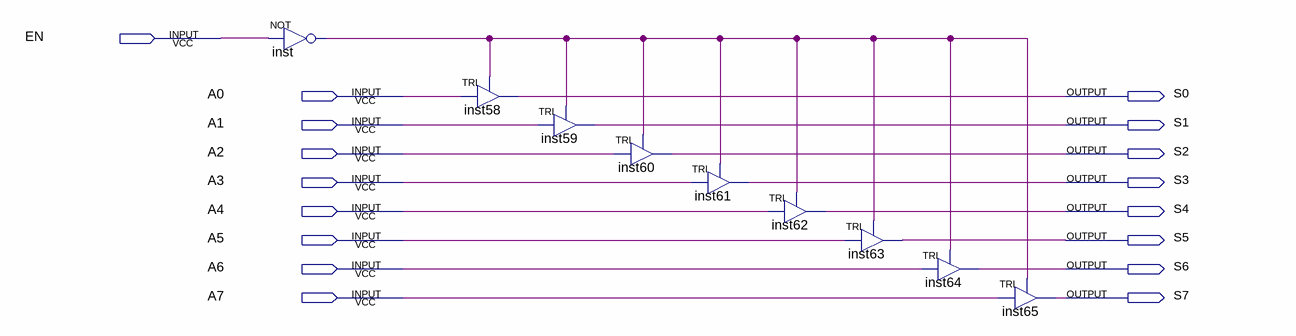
[diagram p0: schematic sheet]
// Quartus schematic Octal_Buffer_Tri.bdf as structural Verilog: 9 symbols, 17 pins
module Octal_Buffer_Tri (
  input  EN,
  input  A0,
  input  A1,
  input  A2,
  input  A3,
  input  A4,
  input  A5,
  input  A6,
  input  A7,
  output S0,
  output S1,
  output S2,
  output S3,
  output S4,
  output S5,
  output S6,
  output S7
);

  wire inst_out;

  not inst (inst_out, EN);
  TRI inst58 (.IN(A0), .OE(inst_out), .OUT(S0));
  TRI inst59 (.IN(A1), .OE(inst_out), .OUT(S1));
  TRI inst60 (.IN(A2), .OE(inst_out), .OUT(S2));
  TRI inst61 (.IN(A3), .OE(inst_out), .OUT(S3));
  TRI inst62 (.IN(A4), .OE(inst_out), .OUT(S4));
  TRI inst63 (.IN(A5), .OE(inst_out), .OUT(S5));
  TRI inst64 (.IN(A6), .OE(inst_out), .OUT(S6));
  TRI inst65 (.IN(A7), .OE(inst_out), .OUT(S7));
endmodule
